# Altium schematic sheet PiCAT-0.2.3.schdoc: PiCAT - Raspberry pi EtherCAT Master
size A3; Author: Ho Tam; Revision: 0.2.3
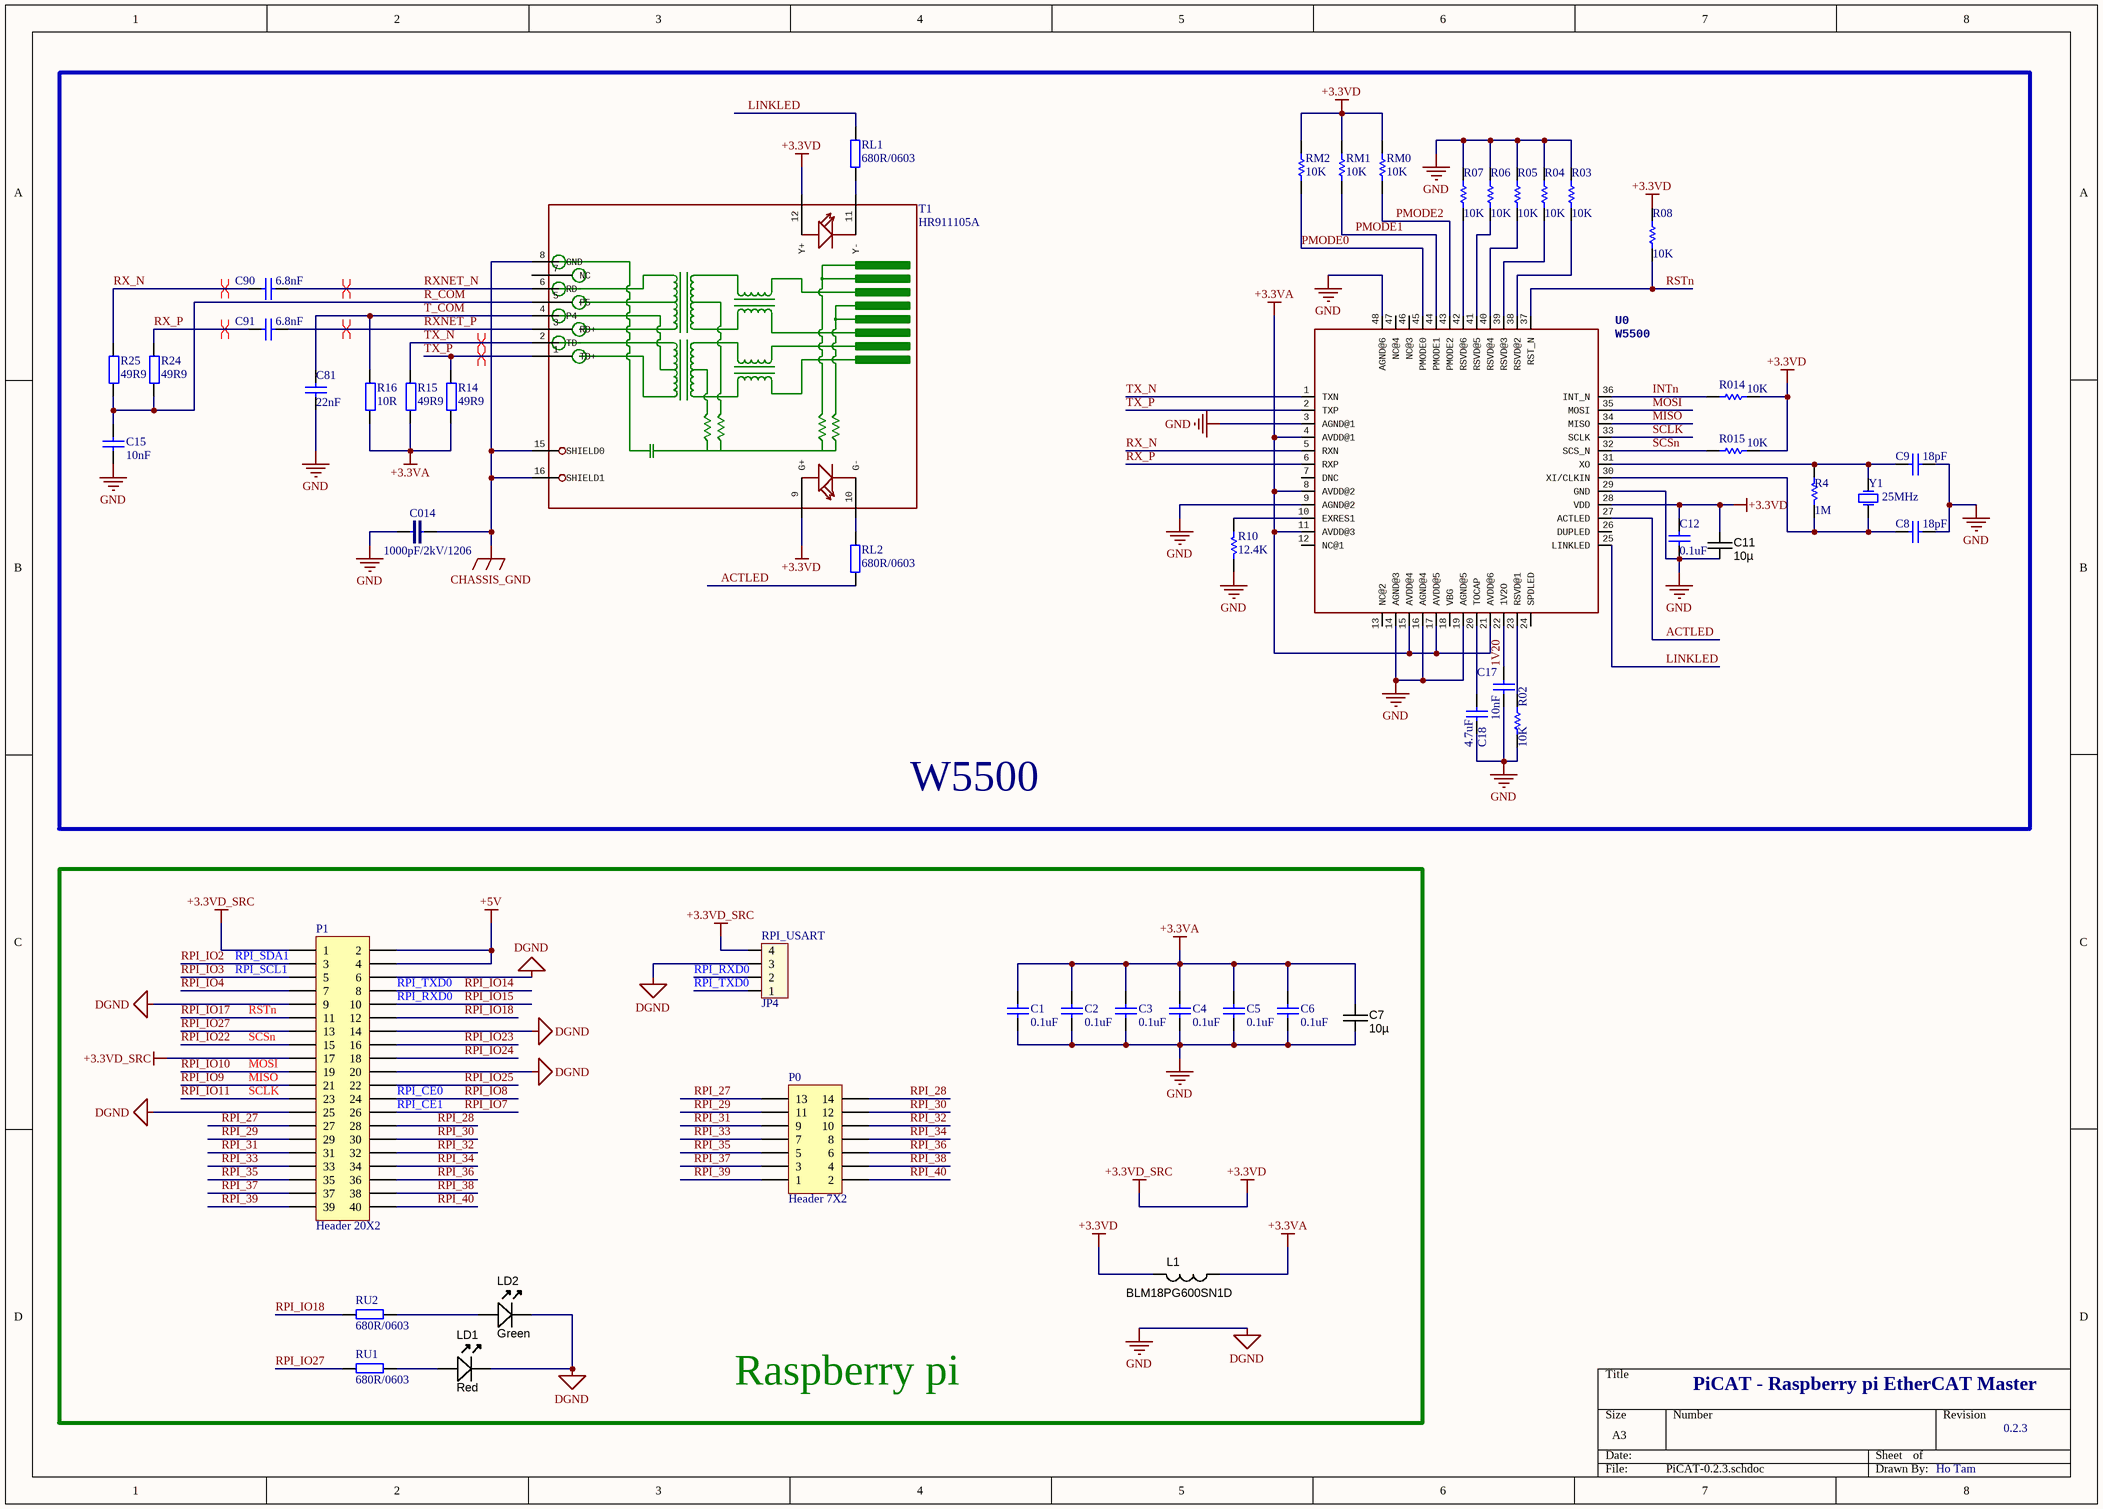
[diagram p0: PiCAT-0.2.3.schdoc]

## Parts
C1  value 0.1uF  [CAPC1608X90N]  (hidden comment: Cap 0.1uF)
C2  value 0.1uF  [CAPC1608X90N]  (hidden comment: Cap 0.1uF)
C3  value 0.1uF  [CAPC1608X90N]  (hidden comment: Cap 0.1uF)
C4  value 0.1uF  [CAPC1608X90N]  (hidden comment: Cap 0.1uF)
C5  value 0.1uF  [CAPC1608X90N]  (hidden comment: Cap 0.1uF)
C6  value 0.1uF  [CAPC1608X90N]  (hidden comment: Cap 0.1uF)
C7  value 10µ  [CAPC2012X135N]  (hidden comment: approved sub OK)
C8  value 18pF  [CAPC1608X90N]  (hidden comment: Cap 18pF)
C9  value 18pF  [CAPC1608X90N]  (hidden comment: Cap 18pF)
C11  value 10µ  [CAPC2012X135N]  (hidden comment: approved sub OK)
C12  value 0.1uF  [CAPC1608X90N]  (hidden comment: Cap 0.1uF)
C014  1000pF/2kV/1206  [CAPC3216X100N]
C15  value 10nF  [CAPC1608X90N]  (hidden comment: Cap 10nF)
C17  value 10nF  [CAPC1608X90N]  (hidden comment: Cap 10nF)
C18  value 4.7uF  [CAPC1608X90N]  (hidden comment: Cap 4.7uF)
C81  value 22nF  [CAPC1608X90N]  (hidden comment: Cap 22nF)
C90  value 6.8nF  [CAPC1608X90N]  (hidden comment: Cap 6.8nF)
C91  value 6.8nF  [CAPC1608X90N]  (hidden comment: Cap 6.8nF)
L1  BLM18PG600SN1D  [FBC1608X95N]
LD1  Red  [LED-0603-RED]
LD2  Green  [LED-0603-GREEN]
P0  Header 7X2  [HDR2X7]
P1  Header 20X2  [HDR2X20]
R02  value 10K  [RESC1608X55N]  (hidden comment: Res 10K)
R03  value 10K  [RESC1608X55N]  (hidden comment: Res 10K)
R4  value 1M  [RESC1608X55N]  (hidden comment: Res 1M)
R04  value 10K  [RESC1608X55N]  (hidden comment: Res 10K)
R05  value 10K  [RESC1608X55N]  (hidden comment: Res 10K)
R06  value 10K  [RESC1608X55N]  (hidden comment: Res 10K)
R07  value 10K  [RESC1608X55N]  (hidden comment: Res 10K)
R08  value 10K  [RESC1608X55N]  (hidden comment: Res 10K)
R10  value 12.4K  [RESC1608X55N]  (hidden comment: Res 12.4K)
R014  value 10K  [RESC1608X55N]  (hidden comment: Res 10K)
R14  49R9  [RESC1608X55N]
R015  value 10K  [RESC1608X55N]  (hidden comment: Res 10K)
R15  49R9  [RESC1608X55N]
R16  10R  [RESC1608X55N]
R24  49R9  [RESC1608X55N]
R25  49R9  [RESC1608X55N]
RL1  680R/0603  [RESC1608X55N]
RL2  680R/0603  [RESC1608X55N]
RM0  value 10K  [RESC1608X55N]  (hidden comment: Res 10K)
RM1  value 10K  [RESC1608X55N]  (hidden comment: Res 10K)
RM2  value 10K  [RESC1608X55N]  (hidden comment: Res 10K)
RPI_USART  JP4  [JST-4]
RU1  680R/0603  [RESC1608X55N]
RU2  680R/0603  [RESC1608X55N]
T1  HR911105A  [RJ45ALED_1PRIMARY_MOD]
U0  W5500  [W5500]
Y1  25MHz  [XTAL]

## Blocks framed on the sheet
W5500: C8 C9 C11 C12 C014 C15 C17 C18 C81 C90 C91 R02 R03 R04 R4 R05 R06 R07 R08 R10 R014 R14 R015 R15 R16 R24 R25 RL1 RL2 RM0-RM2 T1 U0 Y1
Raspberry pi: C1-C7 L1 LD1 LD2 P0 P1 RPI_USART RU1 RU2

## Nets
+3.3VA: C1.2 C2.2 C3.2 C4.2 C5.2 C6.2 C7.1 L1.1 R14.2 R15.2 R16.2 U0.4(AVDD@1) U0.8(AVDD@2) U0.11(AVDD@3) U0.15(AVDD@4) U0.17(AVDD@5) U0.21(AVDD@6)
+3.3VD: C11.1 C12.2 L1.2 P1.1 P1.17 R08.2 R014.1 R015.1 RM0.2 RM1.2 RM2.2 RPI_USART.4 T1.9(G+) T1.12(Y+) U0.28(VDD)  [also labelled +3.3VD_SRC]
+5V: P1.2 P1.4
CHASSIS_GND: C014.2 T1.8(GND) T1.15(SHIELD0) T1.16(SHIELD1)
DGND: C1.1 C2.1 C3.1 C4.1 C5.1 C6.1 C7.2 C8.1 C9.1 C11.2 C12.1 C014.1 C15.1 C17.1 C18.2 C81.2 LD1.K LD2.K P1.6 P1.9 P1.14 P1.20 P1.25 R02.1 R03.2 R04.2 R05.2 R06.2 R07.2 R10.1 RPI_USART.3 U0.3(AGND@1) U0.9(AGND@2) U0.14(AGND@3) U0.16(AGND@4) U0.19(AGND@5) U0.29(GND) U0.48(AGND@6)  [also labelled GND]
1V20: C17.2 U0.22(1V2O)
ACTLED: RL2.1 U0.27(ACTLED)
INTn: R014.2 U0.36(INT_N)
LINKLED: RL1.2 U0.25(LINKLED)
MISO: P1.21 U0.34(MISO)  [also labelled RPI_IO9]
MOSI: P1.19 U0.35(MOSI)  [also labelled RPI_IO10]
PMODE0: RM2.1 U0.45(PMODE0)
PMODE1: RM1.1 U0.44(PMODE1)
PMODE2: RM0.1 U0.43(PMODE2)
R_COM: C15.2 R24.2 R25.2 T1.5(P5)
RPI_27: P0.13 P1.27
RPI_28: P0.14 P1.28
RPI_29: P0.11 P1.29
RPI_30: P0.12 P1.30
RPI_31: P0.9 P1.31
RPI_32: P0.10 P1.32
RPI_33: P0.7 P1.33
RPI_34: P0.8 P1.34
RPI_35: P0.5 P1.35
RPI_36: P0.6 P1.36
RPI_37: P0.3 P1.37
RPI_38: P0.4 P1.38
RPI_39: P0.1 P1.39
RPI_40: P0.2 P1.40
RPI_CE0: P1.24  [also labelled RPI_IO8]
RPI_CE1: P1.26  [also labelled RPI_IO7]
RPI_IO2: P1.3  [also labelled RPI_SDA1]
RPI_IO3: P1.5  [also labelled RPI_SCL1]
RPI_IO4: P1.7
RPI_IO11: P1.23 U0.33(SCLK)  [also labelled SCLK]
RPI_IO14: P1.8 RPI_USART.1  [also labelled RPI_TXD0]
RPI_IO15: P1.10 RPI_USART.2  [also labelled RPI_RXD0]
RPI_IO17: P1.11 R08.1 U0.37(RST_N)  [also labelled RSTn]
RPI_IO18: P1.12 RU2.1
RPI_IO22: P1.15 R015.2 U0.32(SCS_N)  [also labelled SCSn]
RPI_IO23: P1.16
RPI_IO24: P1.18
RPI_IO25: P1.22
RPI_IO27: P1.13 RU1.1
RX_N: C90.2 R25.1 U0.5(RXN)
RX_P: C91.2 R24.1 U0.6(RXP)
RXNET_N: C90.1 T1.6(RD-)
RXNET_P: C91.1 T1.3(RD+)
T_COM: C81.1 R16.1 T1.4(P4)
TX_N: R15.1 T1.2(TD-) U0.1(TXN)
TX_P: R14.1 T1.1(TD+) U0.2(TXP)
NetC8_2: C8.2 R4.2 U0.30(XI/CLKIN) Y1.1(OSC1)
NetC9_2: C9.2 R4.1 U0.31(XO) Y1.2(OSC2)
NetC18_1: C18.1 U0.20(TOCAP)
NetLD1_A: LD1.A RU1.2
NetLD2_A: LD2.A RU2.2
NetR02_2: R02.2 U0.23(RSVD@1)
NetR03_1: R03.1 U0.38(RSVD@2)
NetR04_1: R04.1 U0.39(RSVD@3)
NetR05_1: R05.1 U0.40(RSVD@4)
NetR06_1: R06.1 U0.41(RSVD@5)
NetR07_1: R07.1 U0.42(RSVD@6)
NetR10_2: R10.2 U0.10(EXRES1)
NetRL1_1: RL1.1 T1.11(Y-)
NetRL2_2: RL2.2 T1.10(G-)

Not connected (* = marked no-connect by the designer): T1 7(NC); U0 7(DNC) 12(NC@1) 13(NC@2) 18(VBG) 24(SPDLED) 26(DUPLED) 46(NC@3) 47(NC@4)

## Layout directives
differential pair: RX_N, RX_P, RXNET_N, RXNET_P, TX_N, TX_P

## Library data of the parts
C1-C6 C12 = Cap: Capacitor 0.1uF, SMD 1608; Published: 8-Jun-2000; LatestRevisionDate: 17-Jul-2002; LatestRevisionNote: Re-released for DXP Platform.; PackageReference: RAD-0.3; Publisher: Altium Limited; PackageDescription: Radial Cap, Thru-Hole; 2 Leads; 0.3 in Pin Spacing
C7 C11 = CAPC_10u_0805_16V: Capacitor SMD Cer 10uF 10% 16V X7R 0805; Manufacturer 1: Samsung; Manufacturer Part Number 1: CL21B106KBN; Ratings: 16V; X7R; Material: ceramic; SCDType: undef; Package / Case: 0805 (2012 metric); Tolerance: ±10%
C8 C9 = Cap: Capacitor 20pF, SMD 1608; Published: 8-Jun-2000; LatestRevisionDate: 17-Jul-2002; LatestRevisionNote: Re-released for DXP Platform.; PackageReference: RAD-0.3; Publisher: Altium Limited; PackageDescription: Radial Cap, Thru-Hole; 2 Leads; 0.3 in Pin Spacing
C014 = C-EUC1206K: Capacitor 1000pF, SMD_1206
C15 C17 = Cap: Capacitor 10nF, SMD 1608; Published: 8-Jun-2000; LatestRevisionDate: 17-Jul-2002; LatestRevisionNote: Re-released for DXP Platform.; PackageReference: RAD-0.3; Publisher: Altium Limited; PackageDescription: Radial Cap, Thru-Hole; 2 Leads; 0.3 in Pin Spacing
C18 = Cap: Capacitor 4.7uF, 5%, 10VDC, SMD 1608; Published: 8-Jun-2000; LatestRevisionDate: 17-Jul-2002; LatestRevisionNote: Re-released for DXP Platform.; PackageReference: RAD-0.3; Publisher: Altium Limited; PackageDescription: Radial Cap, Thru-Hole; 2 Leads; 0.3 in Pin Spacing
C81 = Cap: Capacitor 22nF, SMD 1608; Published: 8-Jun-2000; LatestRevisionDate: 17-Jul-2002; LatestRevisionNote: Re-released for DXP Platform.; PackageReference: RAD-0.3; Publisher: Altium Limited; PackageDescription: Radial Cap, Thru-Hole; 2 Leads; 0.3 in Pin Spacing
C90 C91 = Cap: Capacitor 6.8nF, 5%, SMD 1608; Published: 8-Jun-2000; LatestRevisionDate: 17-Jul-2002; LatestRevisionNote: Re-released for DXP Platform.; PackageReference: RAD-0.3; Publisher: Altium Limited; PackageDescription: Radial Cap, Thru-Hole; 2 Leads; 0.3 in Pin Spacing
L1 = FERRITE_2K2-100MHz_0603: Ferrite bead 60 Ohm at 100 MHz 500mA 0603 SMD; Manufacturer 1: TDK Corporation; Manufacturer Part Number 1: MMZ1608A222B; Ratings: 500 mA; 800 mOhm DC; Impedance @ Frequency: 2200 Ohm @ 100MHz; DC Resistance (DCR): 800 mOhm Max; Filter Type: Differential Mode - Single; SCDType: source; Value: 60 @ 100 MHz; Size / Dimension: 0.063" L x 0.031" W (1.60mm x 0.80mm); Current Rating: 500mA; Package / Case: 0603 (1608 Metric); Height (Max): 0.037" (0.95mm); Mounting Type: Surface Mount; Supplier 1: Digi-Key; Supplier Part Number 1: 445-8671-1-ND; RoHS 1: RoHS Compliant; ComponentLink1URL: http://www.tdk.co.jp/tefe02/e9412_mmz.pdf; ComponentLink1Description: http://www.tdk.co.jp/tefe02/e9412_mmz.pdf
LD1 = LED_SMD_Red_0603_220mcd: LED 0603 SMD Hyper Red 630nm 220mcd 20mA; Manufacturer 1: Kingbright Company LLC; Manufacturer Part Number 1: APT1608SURCK; Material: AlGaInP on GaAs; Ratings: 220 mcd; 630 nm; Voltage - Forward (Vf) Typ: 1.95V; Voltage - Forward (Vf) @ 10mA: 1.9V; SCDType: source; Package / Case: 0603 (1608 metric); Supplier 1: Digi-Key; Supplier Part Number 1: 754-1123-1-ND; ComponentLink1URL: http://www.us.kingbright.com/images/catalog/SPEC/APT1608SURCK.pdf; ComponentLink1Description: http://www.us.kingbright.com/images/catalog/SPEC/APT1608SURCK.pdf
LD2 = LED_SMD_Green_0603_570nm: LED 0603 SMD Green 570nm 50mcd 20mA; Manufacturer 1: Kingbright Company LLC; Manufacturer Part Number 1: APT1608CGCK; Material: AlGaInP; Ratings: 20mcd min; 50 mcd typ; 570 nm; Voltage - Forward (Vf) Typ: 2.1V; Viewing Angle: 120°; Lens Style/Size: Rectangle with Flat Top, 1.1mm x 0.8mm; Voltage - Forward (Vf) @ 10mA: 2.0V; SCDType: source; Wavelength - Peak: 574nm; Lens Type: Clear; Package / Case: 0603 (1608 metric); Color: Green; Current - Test: 20mA; Supplier 1: Digi-Key; Supplier Part Number 1: 754-1116-1-ND; RoHS 1: RoHS Compliant; Wavelength - Dominant: 570nm; ComponentLink1URL: http://www.us.kingbright.com/images/catalog/SPEC/APT1608CGCK.pdf; ComponentLink1Description: http://www.us.kingbright.com/images/catalog/SPEC/APT1608CGCK.pdf
P0 = Header 7X2: Header, 7-Pin, Dual row; LatestRevisionDate: 17-Jul-2002; LatestRevisionNote: Re-released for DXP Platform.; Publisher: Altium Limited
P1 = Header 20X2: Header, 20-Pin, Dual row; LatestRevisionDate: 17-Jul-2002; LatestRevisionNote: Re-released for DXP Platform.; Publisher: Altium Limited
R02 R03 R04 R05 R06 R07 R08 R014 R015 RM0-RM2 = Res1: Resistor 12.4K, SMD 1608; Published: 8-Jun-2000; LatestRevisionDate: 17-Jul-2002; LatestRevisionNote: Re-released for DXP Platform.; PackageReference: AXIAL-0.3; Publisher: Altium Limited; PackageDescription: Axial Device, Thru-Hole; 2 Leads; 0.3 in Pin Spacing
R4 = Res1: Resistor 0R, SMD 1608; Published: 8-Jun-2000; LatestRevisionDate: 17-Jul-2002; LatestRevisionNote: Re-released for DXP Platform.; PackageReference: AXIAL-0.3; Publisher: Altium Limited; PackageDescription: Axial Device, Thru-Hole; 2 Leads; 0.3 in Pin Spacing
R10 = Res1: Resistor 12.4K, 1%, SMD 1608; Published: 8-Jun-2000; LatestRevisionDate: 17-Jul-2002; LatestRevisionNote: Re-released for DXP Platform.; PackageReference: AXIAL-0.3; Publisher: Altium Limited; PackageDescription: Axial Device, Thru-Hole; 2 Leads; 0.3 in Pin Spacing
R14 R15 R24 R25 = R-EU_R0603: Resistor 49.9 Ohm, 1%, SMD 1608
R16 = R-EU_R0603: Resistor 10.0 Ohm, 1%, SMD 1608
RL1 RL2 RU1 RU2 = R-EU_R0603: Resistor 680R, SMD 1608
RPI_USART = JST-4: Connector 4; Value: Connector 4
T1 = HR911105AHR911105A: Hanrun HR911105A Ethernet port with transformer; MF: HanRun; MP: HR911105A; Price: 1.79 USD; Availability: Unavailable; Package: None
U0 = W5500: Wiznet Fast SPI Ethernet controller
Y1 = XTAL: 25MHz Crystal Oscillator; Published: 8-Jun-2000; LatestRevisionDate: 17-Jul-2002; LatestRevisionNote: Re-released for DXP Platform.; PackageReference: R38; Publisher: Altium Limited